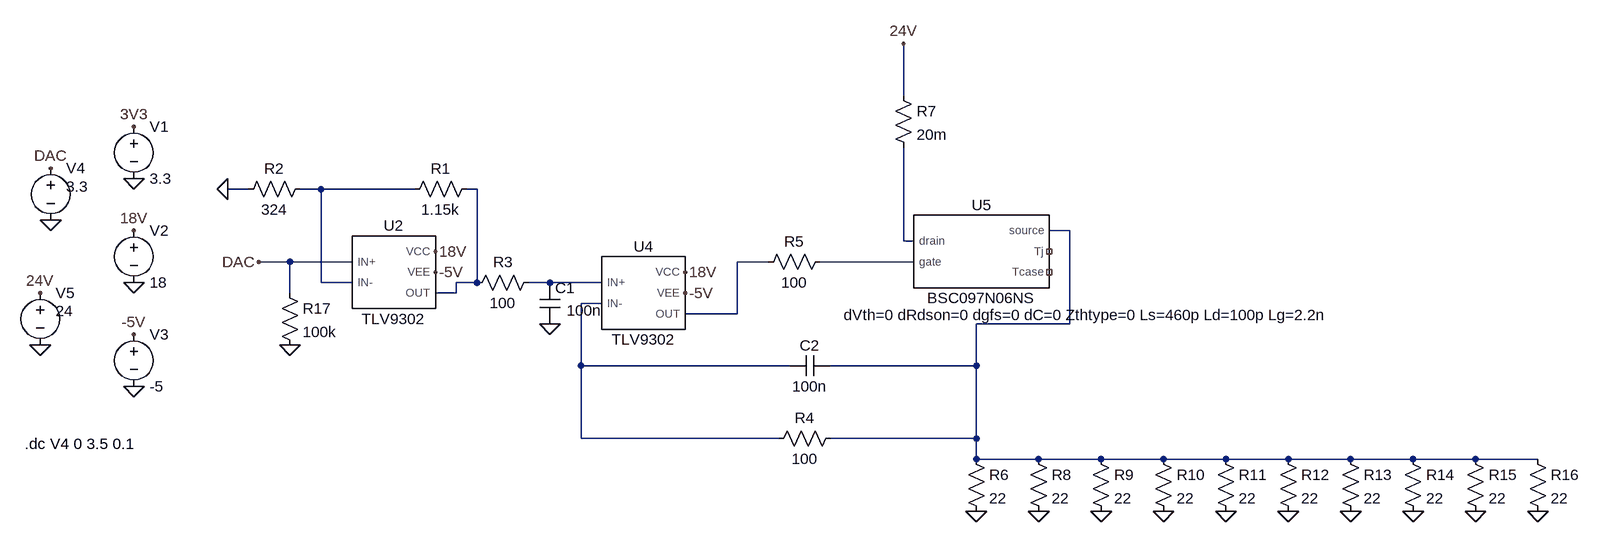
[diagram p0: schematic Programmable Load.asc]
Programmable Load.asc, the LTspice schematic file:
Version 4
SHEET 1 2336 680
WIRE 848 -16 848 -96
WIRE -160 128 -192 128
WIRE -48 128 -80 128
WIRE 96 128 -48 128
WIRE 192 128 176 128
WIRE 1104 192 1072 192
WIRE 848 208 848 64
WIRE 864 208 848 208
WIRE -96 240 -144 240
WIRE 0 240 -96 240
WIRE 640 240 592 240
WIRE 864 240 720 240
WIRE -48 272 -48 128
WIRE 0 272 -48 272
WIRE 192 272 192 128
WIRE 192 272 160 272
WIRE 304 272 272 272
WIRE 384 272 304 272
WIRE -96 288 -96 240
WIRE 160 288 160 272
WIRE 160 288 128 288
WIRE 384 304 352 304
WIRE 592 320 592 240
WIRE 592 320 512 320
WIRE 1104 336 1104 192
WIRE 1104 336 960 336
WIRE 352 400 352 304
WIRE 672 400 352 400
WIRE 960 400 960 336
WIRE 960 400 736 400
WIRE 352 512 352 400
WIRE 656 512 352 512
WIRE 960 512 960 400
WIRE 960 512 736 512
WIRE 960 544 960 512
WIRE 1056 544 960 544
WIRE 1152 544 1056 544
WIRE 1248 544 1152 544
WIRE 1344 544 1248 544
WIRE 1440 544 1344 544
WIRE 1536 544 1440 544
WIRE 1632 544 1536 544
WIRE 1728 544 1632 544
WIRE 1824 544 1728 544
FLAG -336 272 0
FLAG -336 112 0
FLAG -336 192 18V
FLAG -336 32 3V3
FLAG -336 432 0
FLAG -336 352 -5V
FLAG 128 256 -5V
FLAG -464 176 0
FLAG -464 96 DAC
FLAG -144 240 DAC
FLAG -192 128 0
FLAG 304 336 0
FLAG 512 288 -5V
FLAG -480 368 0
FLAG -480 288 24V
FLAG 848 -96 24V
FLAG 960 624 0
FLAG 1056 624 0
FLAG 1152 624 0
FLAG 1248 624 0
FLAG 1344 624 0
FLAG 1440 624 0
FLAG 1536 624 0
FLAG 1632 624 0
FLAG 1728 624 0
FLAG 1824 624 0
FLAG -96 368 0
FLAG 128 224 18V
FLAG 512 256 18V
SYMBOL res 192 112 R90
WINDOW 0 0 56 VBottom 2
WINDOW 3 32 56 VTop 2
SYMATTR InstName R1
SYMATTR Value 1.15k
SYMBOL res -64 112 R90
WINDOW 0 0 56 VBottom 2
WINDOW 3 32 56 VTop 2
SYMATTR InstName R2
SYMATTR Value 324
SYMBOL voltage -336 16 R0
WINDOW 123 0 0 Left 0
WINDOW 39 0 0 Left 0
SYMATTR InstName V1
SYMATTR Value 3.3
SYMBOL voltage -336 176 R0
WINDOW 123 0 0 Left 0
WINDOW 39 0 0 Left 0
SYMATTR InstName V2
SYMATTR Value 18
SYMBOL voltage -336 336 R0
WINDOW 123 0 0 Left 0
WINDOW 39 0 0 Left 0
SYMATTR InstName V3
SYMATTR Value -5
SYMBOL voltage -464 80 R0
WINDOW 123 0 0 Left 0
WINDOW 39 0 0 Left 0
WINDOW 3 24 44 Left 2
SYMATTR Value 3.3
SYMATTR InstName V4
SYMBOL res 288 256 R90
WINDOW 0 0 56 VBottom 2
WINDOW 3 32 56 VTop 2
SYMATTR InstName R3
SYMATTR Value 100
SYMBOL cap 288 272 R0
WINDOW 3 42 43 Left 2
SYMATTR Value 100n
SYMATTR InstName C1
SYMBOL res 752 496 R90
WINDOW 0 0 56 VBottom 2
WINDOW 3 32 56 VTop 2
SYMATTR InstName R4
SYMATTR Value 100
SYMBOL cap 736 384 R90
WINDOW 0 0 32 VBottom 2
WINDOW 3 32 32 VTop 2
SYMATTR InstName C2
SYMATTR Value 100n
SYMBOL res 736 224 R90
WINDOW 0 0 56 VBottom 2
WINDOW 3 32 56 VTop 2
SYMATTR InstName R5
SYMATTR Value 100
SYMBOL res 832 -32 R0
SYMATTR InstName R7
SYMATTR Value 20m
SYMBOL voltage -480 272 R0
WINDOW 123 0 0 Left 0
WINDOW 39 0 0 Left 0
WINDOW 3 24 44 Left 2
SYMATTR Value 24
SYMATTR InstName V5
SYMBOL res 944 528 R0
SYMATTR InstName R6
SYMATTR Value 22
SYMATTR SpiceLine pwr=10
SYMBOL res 1040 528 R0
SYMATTR InstName R8
SYMATTR Value 22
SYMATTR SpiceLine pwr=10
SYMBOL res 1136 528 R0
SYMATTR InstName R9
SYMATTR Value 22
SYMATTR SpiceLine pwr=10
SYMBOL res 1232 528 R0
SYMATTR InstName R10
SYMATTR Value 22
SYMATTR SpiceLine pwr=10
SYMBOL res 1328 528 R0
SYMATTR InstName R11
SYMATTR Value 22
SYMATTR SpiceLine pwr=10
SYMBOL res 1424 528 R0
SYMATTR InstName R12
SYMATTR Value 22
SYMATTR SpiceLine pwr=10
SYMBOL res 1520 528 R0
SYMATTR InstName R13
SYMATTR Value 22
SYMATTR SpiceLine pwr=10
SYMBOL res 1616 528 R0
SYMATTR InstName R14
SYMATTR Value 22
SYMATTR SpiceLine pwr=10
SYMBOL res 1712 528 R0
SYMATTR InstName R15
SYMATTR Value 22
SYMATTR SpiceLine pwr=10
SYMBOL res 1808 528 R0
SYMATTR InstName R16
SYMATTR Value 22
SYMATTR SpiceLine pwr=10
SYMBOL res -112 272 R0
SYMATTR InstName R17
SYMATTR Value 100k
SYMBOL TLV9302 64 256 R0
SYMATTR InstName U2
SYMBOL TLV9302 448 288 R0
SYMATTR InstName U4
SYMBOL BSC097N06NS 960 224 R0
WINDOW 39 173 82 Top 2
SYMATTR InstName U5
TEXT -504 520 Left 2 !.dc V4 0 3.5 0.1

The netlist it stands for:
* Programmable Load.asc
R1 N002 N001 1.15k
R2 N001 0 324
V1 3V3 0 3.3
V2 18V 0 18
V3 -5V 0 -5
V4 DAC 0 3.3
R3 N007 N002 100
C1 N007 0 100n
R4 N003 N008 100
C2 N003 N008 100n
R5 N006 N005 100
R7 24V N004 20m
V5 24V 0 24
R6 N003 0 22 pwr=10
R8 N003 0 22 pwr=10
R9 N003 0 22 pwr=10
R10 N003 0 22 pwr=10
R11 N003 0 22 pwr=10
R12 N003 0 22 pwr=10
R13 N003 0 22 pwr=10
R14 N003 0 22 pwr=10
R15 N003 0 22 pwr=10
R16 N003 0 22 pwr=10
R17 DAC 0 100k
XU2 DAC N001 18V -5V N002 TLV9302  ; pins IN+ IN- VCC VEE OUT
XU4 N007 N008 18V -5V N005 TLV9302  ; pins IN+ IN- VCC VEE OUT
XU5 N004 N006 N003 NC_01 NC_02 BSC097N06NS dVth=0 dRdson=0 dgfs=0 dC=0 Zthtype=0 Ls=460p Ld=100p Lg=2.2n  ; pins drain gate source Tj Tcase
.dc V4 0 3.5 0.1
.lib C:\Users\User\Desktop\Other\Projects\Open Source Programmable Load\Open-Source-Programmable-Load\Electrical\Simulations\sbomax4c\tlv9302.lib
.lib C:\Users\User\Desktop\Other\Projects\Open Source Programmable Load\Open-Source-Programmable-Load\Electrical\Simulations\03_OptiMOS_OptiMOS5\OptiMOS_OptiMOS5_60V_LTSpice.lib
.backanno
.end